# Altium project SEN_REVC.PrjPcb
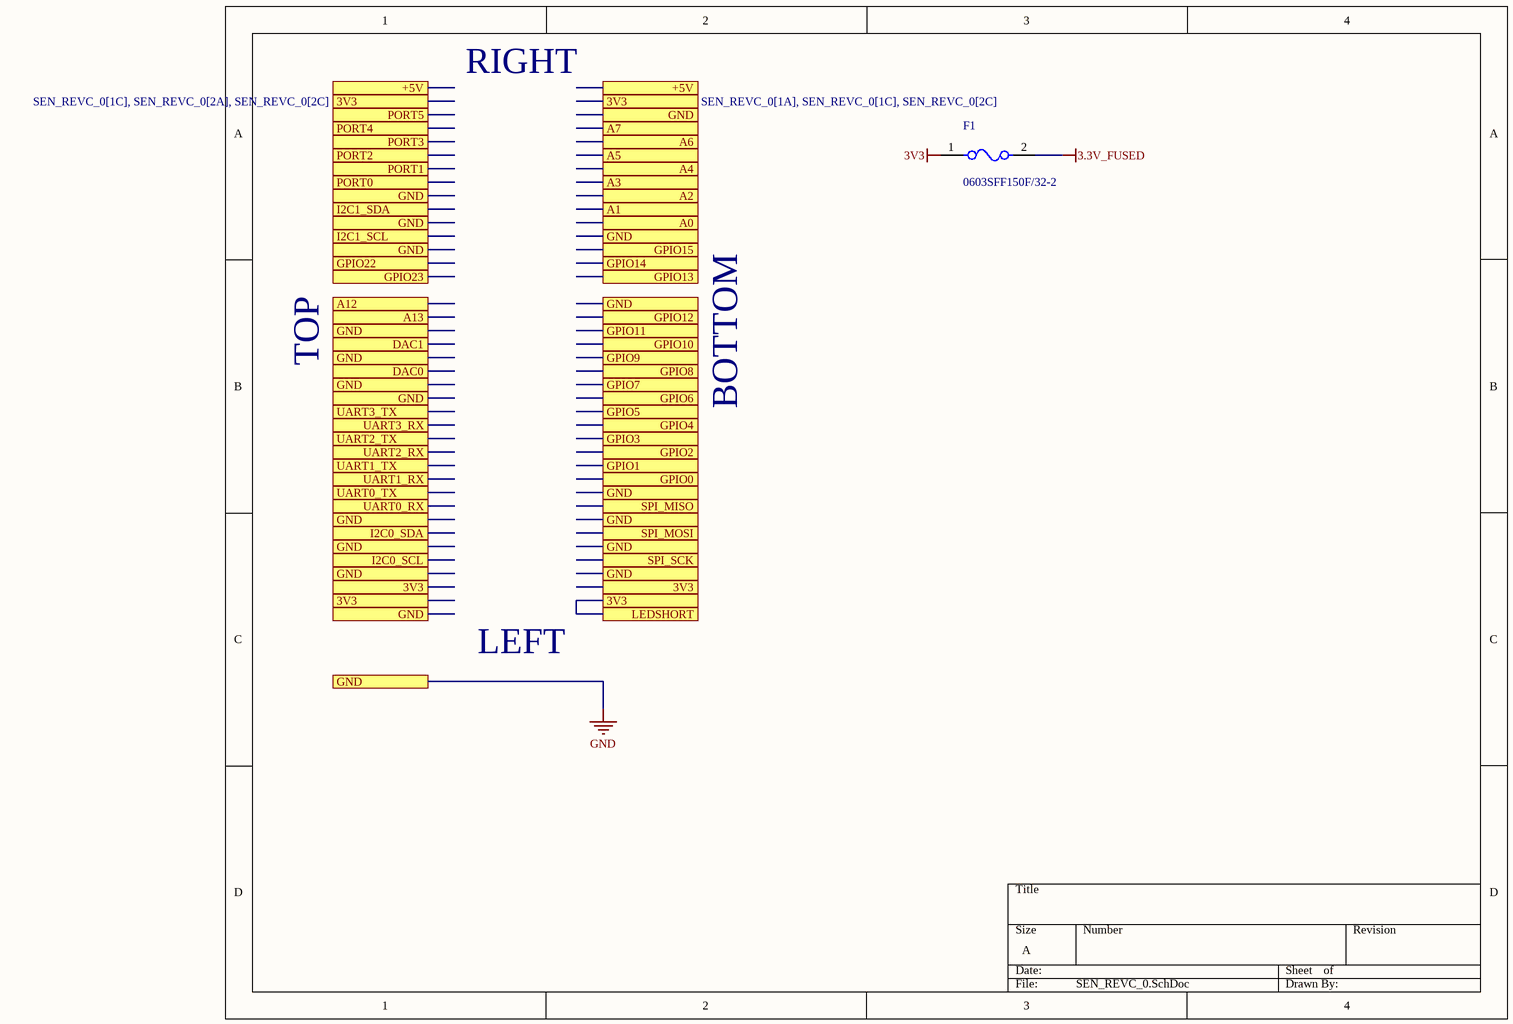
[diagram p0: SEN_REVC_0.SchDoc]
3 sheets, 59 parts. Net scope: flat (ports and power ports of the same name join across sheets).
Board file: SEN_REVC.PcbDoc
Sheets:
  SEN_REVC_0.SchDoc
  SEN_REVC_1.SchDoc
  SEN_REVC_2.SchDoc

## Sheet SEN_REVC_0.SchDoc
size A; SheetNumber: 1; SheetTotal: 3

### Parts
F1  0603SFF150F/32-2  [RESC1608X10N]

### Ports
3V3 (see SEN_REVC_0[1A], SEN_REVC_0[1C], SEN_REVC_0[2A], SEN_REVC_0[2C]), 3V3 (see SEN_REVC_0[1A], SEN_REVC_0[1C], SEN_REVC_0[2C]), 3V3 (see SEN_REVC_0[1C], SEN_REVC_0[2A], SEN_REVC_0[2C]), +5V (see SEN_REVC_0[1A]), +5V (see SEN_REVC_0[2A]), A0, A1, A2, A3, A4, A5, A6, A7, A12, A13, DAC0, DAC1, GND (see SEN_REVC_0[1A], SEN_REVC_0[1B], SEN_REVC_0[1C], SEN_REVC_0[2A], SEN_REVC_0[2B], SEN_REVC_0[2C]), GPIO0, GPIO1, GPIO2, GPIO3, GPIO4, GPIO5, GPIO6, GPIO7, GPIO8, GPIO9, GPIO10, GPIO11, GPIO12, GPIO13, GPIO14, GPIO15, GPIO22, GPIO23, I2C0_SCL, I2C0_SDA, I2C1_SCL, I2C1_SDA, LEDSHORT, PORT0, PORT1, PORT2, PORT3, PORT4, PORT5, SPI_MISO, SPI_MOSI, SPI_SCK, UART0_RX, UART0_TX, UART1_RX, UART1_TX, UART2_RX, UART2_TX, UART3_RX, UART3_TX

### Nets
3.3V_FUSED: F1.2
3V3: F1.1
3V3: port 3V3, port LEDSHORT  [a separate net that carries the same name]

### Notes on the sheet
- RIGHT
- TOP
- BOTTOM
- LEFT

### Library data of the parts
F1 = CMP-00019-1: 0603SFF Series - 0603 Size Lead-Free, Halogen Free, Fast-Acting Chip Fuse, 1.5 A, 63 VDC, RoHS; Approvals: UL; Fuse Type: Board Mount (Cartridge Style Excluded); DC Cold Resistance: 175mR; Current Rating: 500mA; Value: 175mR; Voltage Rating: 50V; Case/Package: 0603; Pins: 2; Mounting Technology: Surface Mount; Case Code (Metric): 1608; Fuse Current: 500mA; Reach SVHC Compliant: Yes; Series: SF-0603S; Width: 0.8mm; Max Operating Temperature: 105°C; Packaging: Tape and Reel; Depth: 0.8mm; Min Operating Temperature: -20°C; RoHS Compliant: Yes; Package Quantity: 10000; Height: 0.45mm; Length: 1.6mm; Current: 500mA; Case Code (Imperial): 0603; Contact Plating: Tin; Voltage Rating (DC): 50V; Termination: SMD/SMT

## Sheet SEN_REVC_1.SchDoc: Sensors
size 270 x 223 mm; SheetTotal: 3; Origin: Eagle; Date: 2019-04-04 11:51:56 PM; SheetNumber: 2; GateName_1: G$1; SymbolName_1: LETTER_L; LibraryName: frames; DeviceSetName: LETTER_L; GateName_2: G$2; SymbolName_2: DOCFIELD; Sheet: Sheet:; REV: REV:
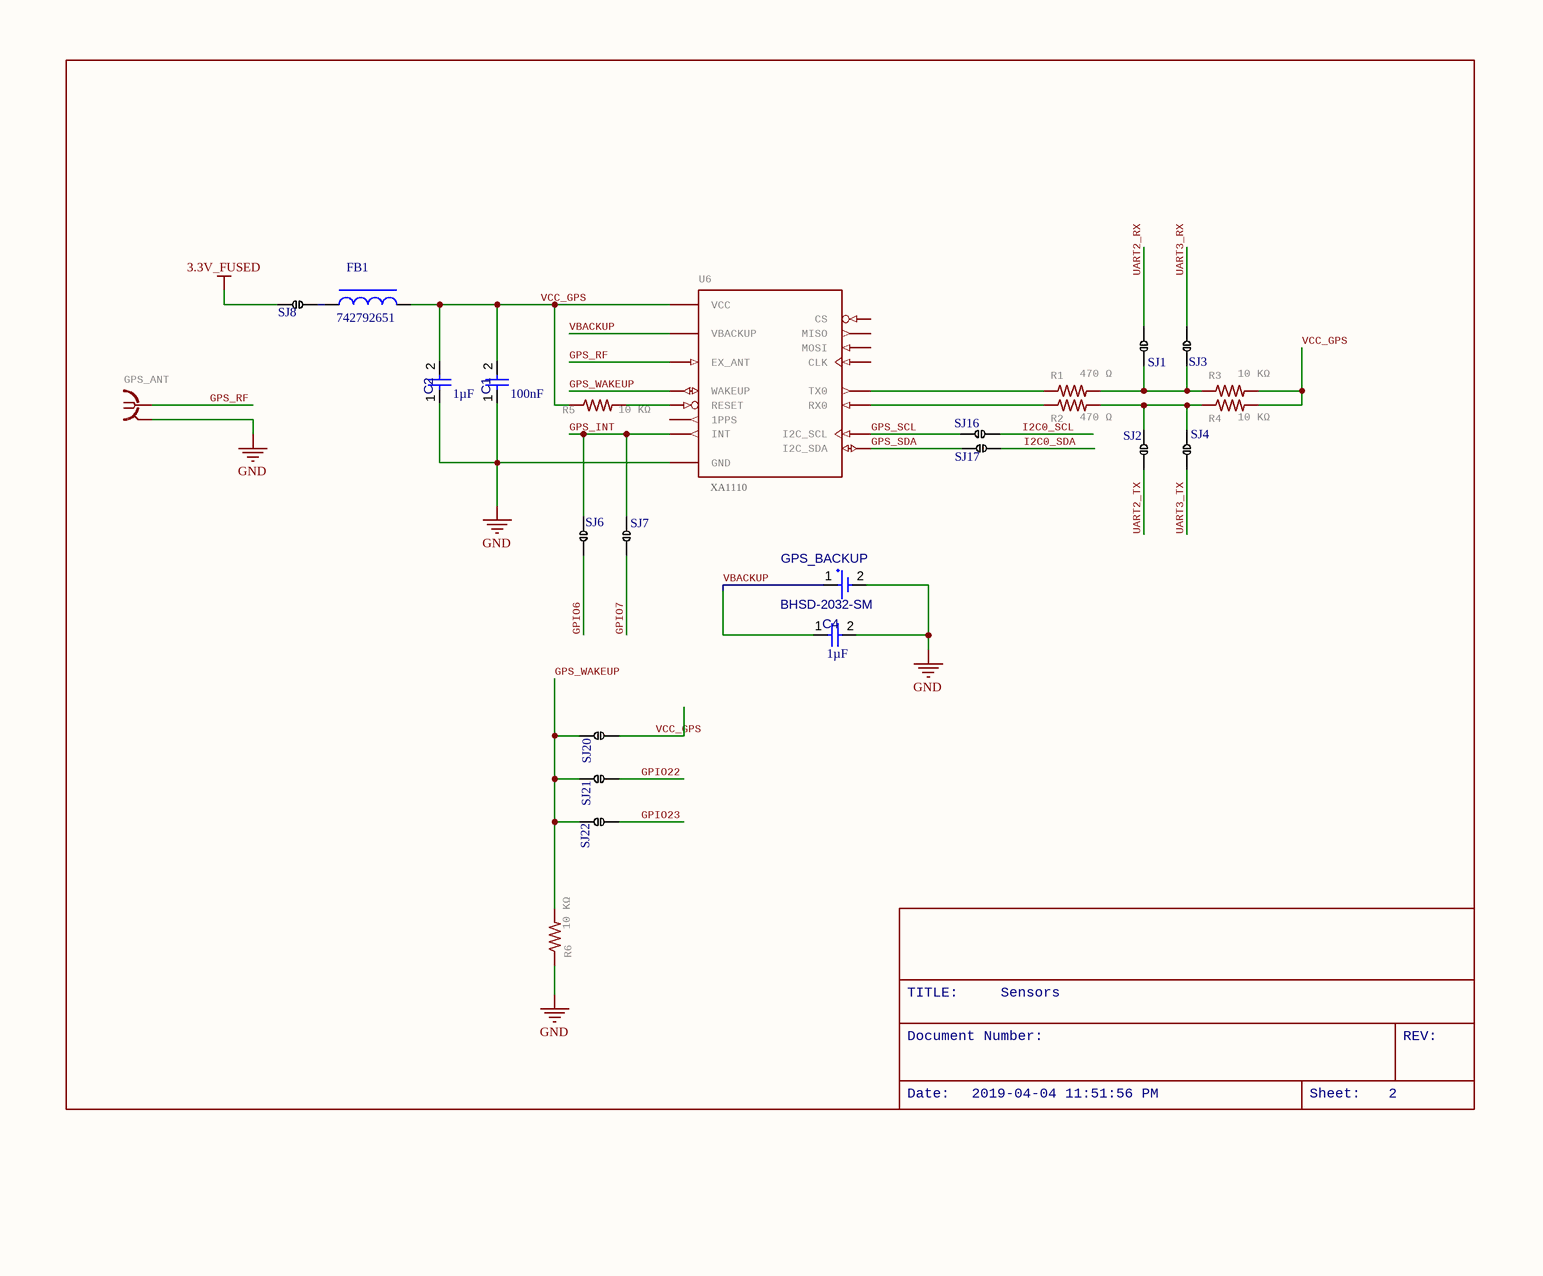
[diagram p1: SEN_REVC_1.SchDoc]

### Parts
C1  value 100nF  [CAPC2013X95X50LL10T25]  (hidden comment: Capacitor 100 nF +/-10% 50 V 0805)
C2  value 1µF  [CAPC2013X135X45NL10T25]  (hidden comment: Capacitor 1 uF +/- 10% 50 V 0805)
C4  value 1µF  [CAPC2013X135X45NL10T25]  (hidden comment: Capacitor 1 uF +/- 10% 50 V 0805)
FB1  742792651  [FP-742792651-MFG]
GPS_ANT  142-0701-801  [CINC-142-0701-801_V]  (value not drawn)
GPS_BACKUP  BHSD-2032-SM  [BHSD-2032-SM-Footprint-1]
R1  470 Ω  [6-0805_N]
R2  470 Ω  [6-0805_N]
R3  10 KΩ  [6-0805_N]
R4  10 KΩ  [6-0805_N]
R5  10 KΩ  [6-0805_N]
R6  10 KΩ  [6-0805_N]
SJ1  Solder Jumper  [Solder Jumper-Footprint-1]  (value not drawn)
SJ2  Solder Jumper  [Solder Jumper-Footprint-1]  (value not drawn)
SJ3  Solder Jumper  [Solder Jumper-Footprint-1]  (value not drawn)
SJ4  Solder Jumper  [Solder Jumper-Footprint-1]  (value not drawn)
SJ6  Solder Jumper  [Solder Jumper-Footprint-1]  (value not drawn)
SJ7  Solder Jumper  [Solder Jumper-Footprint-1]  (value not drawn)
SJ8  Solder Jumper  [Solder Jumper-Footprint-1]  (value not drawn)
SJ16  Solder Jumper  [Solder Jumper-Footprint-1]  (value not drawn)
SJ17  Solder Jumper  [Solder Jumper-Footprint-1]  (value not drawn)
SJ20  Solder Jumper  [Solder Jumper-Footprint-1]  (value not drawn)
SJ21  Solder Jumper  [Solder Jumper-Footprint-1]  (value not drawn)
SJ22  Solder Jumper  [Solder Jumper-Footprint-1]  (value not drawn)
U6  XA1110  [XA1110-Footprint-1]

### Nets
3.3V_FUSED: SJ8.0
GND: C1.1 C2.1 C4.2 GPS_ANT.GND,GND2(GND@1) GPS_BACKUP.2(-) R6.1 U6.P$1,3,4,5,6,9,10,11,24(GND)
GPIO6: SJ6.1
GPIO7: SJ7.1
GPIO22: SJ21.1
GPIO23: SJ22.1
GPS_INT: SJ6.0 SJ7.0 U6.P$16(INT)
GPS_RF: GPS_ANT.RF U6.P$2(EX_ANT)
GPS_SCL: SJ16.0 U6.P$14(I2C_SCL)
GPS_SDA: SJ17.0 U6.P$13(I2C_SDA)
GPS_WAKEUP: R6.2 SJ20.0 SJ21.0 SJ22.0 U6.P$12(WAKEUP)
I2C0_SCL: SJ16.1
I2C0_SDA: SJ17.1
UART2_RX: SJ1.1
UART2_TX: SJ2.1
UART3_RX: SJ3.1
UART3_TX: SJ4.1
VBACKUP: C4.1 GPS_BACKUP.1(+) U6.P$8(VBACKUP)
VCC_GPS: C1.2 C2.2 FB1.2 R3.2 R4.2 R5.1 SJ20.1 U6.P$7(VCC)
NetFB1_1: FB1.1 SJ8.1
NetR1_1: R1.1 U6.P$19(TX0)
NetR1_2: R1.2 R3.1 SJ1.0 SJ3.0
NetR2_1: R2.1 U6.P$20(RX0)
NetR2_2: R2.2 R4.1 SJ2.0 SJ4.0
NetR5_2: R5.2 U6.P$22(RESET)

Not connected (* = marked no-connect by the designer): U6 P$15(MISO) P$17(MOSI) P$18(CLK) P$21(1PPS) P$23(CS)

### Notes on the sheet
- TITLE:
- Sensors
- Document Number:
- REV:
- Date:
- 2019-04-04 11:51:56 PM
- Sheet:
- 2

### Library data of the parts
C1 = CMP-001-00018-6: Chip Capacitor, 100 nF, +/- 10%, 50 V, 0805 (2012 Metric); Capacitor Type: Ceramic; Voltage Rating: 50V; Pins: 2; Max Operating Temperature: 125°C; Min Operating Temperature: -55°C; Mounting Technology: SM; Case/Package: 0805; RoHS Compliant: True; Tolerance: 10%
C2 C4 = CMP-001-00007-6: Chip Capacitor, 1 uF, +/- 10%, 50 V, 0805 (2012 Metric); Capacitor Type: Ceramic; Voltage Rating: 50V; Min Operating Temperature: -55°C; RoHS Compliant: True; Mounting Technology: SM; Case/Package: 0805; Max Operating Temperature: 125°C; Tolerance: 10%; Pins: 2
FB1 = CMP-00022-1: Ferrite Beads WE-CBF 0603 SMD Bead 100MHz 600Ohm 1000mA; Max Current Rating: 1A; Tolerance: 25%; Value: 200mR; Number of Lines: 1; Impedance: 600R; Min Operating Temperature: -55°C; Depth: 0.8mm; Mounting Technology: Surface Mount; Height: 0.8mm; RoHS Compliant: Yes; Package Quantity: 1; Lead Free: Lead Free; Max Operating Temperature: 125°C; Case Code (Imperial): 0603; Case/Package: SMD/SMT; Max DC Current: 1A; Width: 0.8mm; Core Material: Ferrite; Material: Ferrite; Test Frequency: 100MHz; Termination: SMD/SMT; DC Resistance (DCR): 200mR; Weight: 0.000141oz; Packaging: Tape and Reel; Length: 1.6mm; Series: WE-CBF; Case Code (Metric): 1608; Current Rating: 1A
GPS_ANT = CMP-004-000004-3: RF Connectors / Coaxial Connectors SMA ST PCB-JCK STD EMT; pin to pad: GND,GND2>2+3+4+5 RF>1; GateName_1: G$1; SymbolName_1: BNC-F2; Gender: Female; Voltage Rating: 500V; Connector Type: SMA,Coaxial; Plating: Gold; Dielectric Material: PTFE; Mating Cycles: 500; Clock Frequency: 18GHz; Number of Ports: 1; Body Material: Brass; Impedance: 50R; Polarity: Standard; LibraryName: CU inSpace 2019 Parts; DeviceSetName: 5MMSMA; Design Item ID: 5MMSMA; Mounting Technology: Edge; Housing Color: Gold; Operating Frequency: N/A; Lead Free: Lead Free; Radiation Hardening: No; Case/Package: SMA; Fastening Type: Threaded; Orientation: Straight; Max Operating Temperature: 165°C; Package: 5MMSMA; RoHS Compliant: No; Depth: 16.26mm; Length: 6.35mm; Min Operating Temperature: -65°C; Termination: Solder; Series: 73251; Body Plating: Gold; Packaging: Bulk; Package Quantity: 1600; Insulation Material: Polytetrafluoroethylene; Contact Plating: Gold; Contact Material: Copper; Source: CU inSpace 2019 Parts.SCHLIB; Halogen Free: Low Halogen; Center Contact Plating: Gold
GPS_BACKUP = CMP-001-0000-2: Battery Holder 1 Cells Liquid Crystal Polymer Vectra T/R
R1-R6 = R-US_R1206: RESISTOR, American symbol; GateName_1: G$1; SymbolName_1: R-US; DeviceName: R1206; DeviceSetName: R-US_; LibraryName: rcl; SPICEPREFIX: R
SJ1-SJ4 SJ6-SJ8 SJ16 SJ17 SJ20-SJ22 = CMP-00020-3: pin to pad: 0>1 1>2
U6 = CMP-002-000018-2: Rx Txrx Module Surface Mount; pin to pad: P$1,3,4,5,6,9,10,11,24>1+3+4+5+6+9+10+11+24 P$2>2 P$7>7 P$8>8 P$12>12 P$13>13 P$14>14 P$15>15 P$16>16 P$17>17 P$18>18 P$19>19 P$20>20 P$21>21 P$22>22 P$23>23; GateName_1: G$1; SymbolName_1: XA1110; LibraryName: Sensors Board; DeviceSetName: XA1110; Source: Sensors Board.SCHLIB; Pin Count: 16; Design Item ID: XA1110; Package: XA1110; Component Type: Standard

## Sheet SEN_REVC_2.SchDoc: Sensors
size 270 x 223 mm; SheetTotal: 3; Origin: Eagle; Date: 2019-04-04 11:51:56 PM; SheetNumber: 3; GateName_1: G$1; SymbolName_1: LETTER_L; LibraryName: frames; DeviceSetName: LETTER_L; GateName_2: G$2; SymbolName_2: DOCFIELD; Sheet: Sheet:; REV: REV:
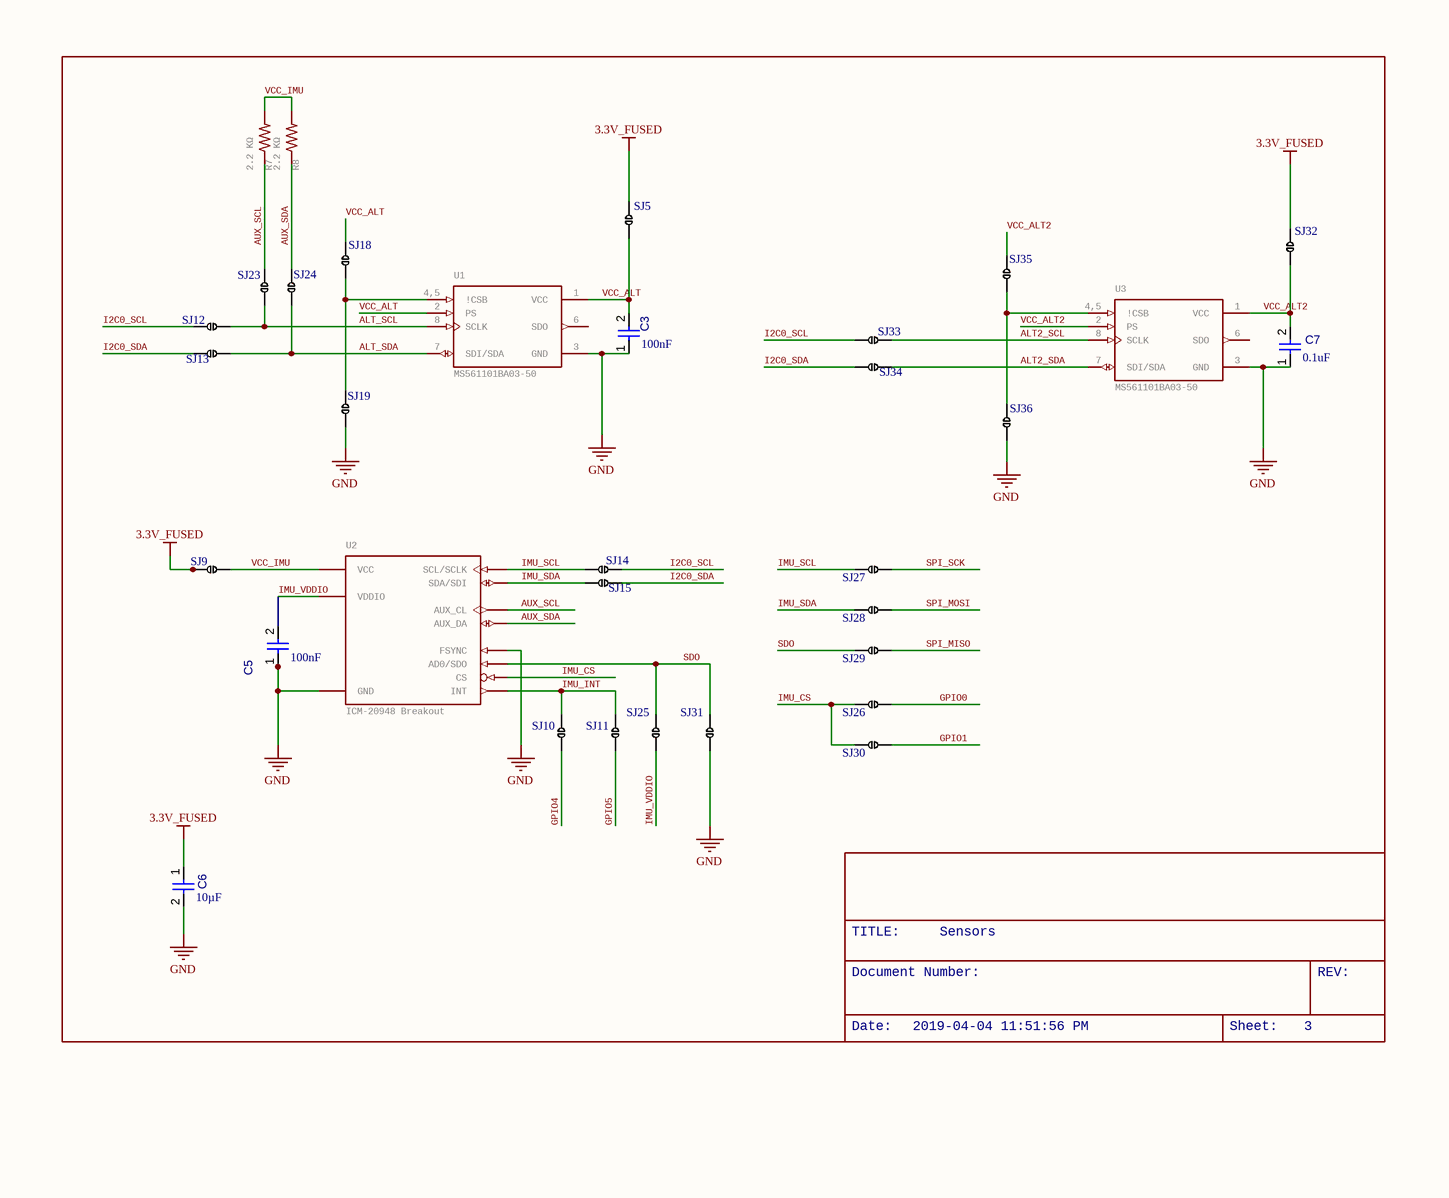
[diagram p2: SEN_REVC_2.SchDoc]

### Parts
C3  value 100nF  [CAPC2013X95X50LL10T25]  (hidden comment: Capacitor 100 nF +/-10% 50 V 0805)
C5  value 100nF  [CAPC2013X95X50LL10T25]  (hidden comment: Capacitor 100 nF +/-10% 50 V 0805)
C6  value 10µF  [CAPC3216X180X50NL20T25]  (hidden comment: Capacitor 10 uF +/- 10% 16 V 1206)
C7  value 0.1uF  [CAPC2013X95X50LL10T25]  (hidden comment: Capacitor 100 nF +/-10% 50 V 0805)
R7  2.2 KΩ  [6-0805_N]
R8  2.2 KΩ  [6-0805_N]
SJ5  Solder Jumper  [Solder Jumper-Footprint-1]  (value not drawn)
SJ9  Solder Jumper  [Solder Jumper-Footprint-1]  (value not drawn)
SJ10  Solder Jumper  [Solder Jumper-Footprint-1]  (value not drawn)
SJ11  Solder Jumper  [Solder Jumper-Footprint-1]  (value not drawn)
SJ12  Solder Jumper  [Solder Jumper-Footprint-1]  (value not drawn)
SJ13  Solder Jumper  [Solder Jumper-Footprint-1]  (value not drawn)
SJ14  Solder Jumper  [Solder Jumper-Footprint-1]  (value not drawn)
SJ15  Solder Jumper  [Solder Jumper-Footprint-1]  (value not drawn)
SJ18  Solder Jumper  [Solder Jumper-Footprint-1]  (value not drawn)
SJ19  Solder Jumper  [Solder Jumper-Footprint-1]  (value not drawn)
SJ23  Solder Jumper  [Solder Jumper-Footprint-1]  (value not drawn)
SJ24  Solder Jumper  [Solder Jumper-Footprint-1]  (value not drawn)
SJ25  Solder Jumper  [Solder Jumper-Footprint-1]  (value not drawn)
SJ26  Solder Jumper  [Solder Jumper-Footprint-1]  (value not drawn)
SJ27  Solder Jumper  [Solder Jumper-Footprint-1]  (value not drawn)
SJ28  Solder Jumper  [Solder Jumper-Footprint-1]  (value not drawn)
SJ29  Solder Jumper  [Solder Jumper-Footprint-1]  (value not drawn)
SJ30  Solder Jumper  [Solder Jumper-Footprint-1]  (value not drawn)
SJ31  Solder Jumper  [Solder Jumper-Footprint-1]  (value not drawn)
SJ32  Solder Jumper  [Solder Jumper-Footprint-1]  (value not drawn)
SJ33  Solder Jumper  [Solder Jumper-Footprint-1]  (value not drawn)
SJ34  Solder Jumper  [Solder Jumper-Footprint-1]  (value not drawn)
SJ35  Solder Jumper  [Solder Jumper-Footprint-1]  (value not drawn)
SJ36  Solder Jumper  [Solder Jumper-Footprint-1]  (value not drawn)
U1  MS561101BA03-50  [MSI-MS561101BA03-50-8_V]
U2  ICM-20948 Breakout  [New footprint 1]
U3  MS561101BA03-50  [MSI-MS561101BA03-50-8_V]

### Nets
3.3V_FUSED: C6.1 SJ5.0 SJ9.0 SJ32.0
GND: C3.1 C5.1 C6.2 C7.1 SJ19.1 SJ31.1 SJ36.1 U1.3(GND) U2.FSYNC U2.GND U3.3(GND)
ALT2_SCL: SJ33.1 U3.8(SCLK)
ALT2_SDA: SJ34.1 U3.7(SDI/SDA)
ALT_SCL: SJ12.1 SJ23.1 U1.8(SCLK)
ALT_SDA: SJ13.1 SJ24.1 U1.7(SDI/SDA)
AUX_SCL: R7.1 SJ23.0 U2.AUX_CL
AUX_SDA: R8.1 SJ24.0 U2.AUX_DA
GPIO0: SJ26.1
GPIO1: SJ30.1
GPIO4: SJ10.1
GPIO5: SJ11.1
I2C0_SCL: SJ12.0 SJ14.1 SJ33.0
I2C0_SDA: SJ13.0 SJ15.1 SJ34.0
IMU_CS: SJ26.0 SJ30.0 U2.NCS(CS)
IMU_INT: SJ10.0 SJ11.0 U2.INT
IMU_SCL: SJ14.0 SJ27.0 U2.SCL/SCLK
IMU_SDA: SJ15.0 SJ28.0 U2.SDA/SDI
IMU_VDDIO: C5.2 SJ25.1 U2.VDDIO
SDO: SJ25.0 SJ29.0 SJ31.0 U2.AD0/SDO
SPI_MISO: SJ29.1
SPI_MOSI: SJ28.1
SPI_SCK: SJ27.1
VCC_ALT: C3.2 SJ5.1 SJ18.0 U1.1(VCC) U1.2(PS)
VCC_ALT2: C7.2 SJ32.1 SJ35.0 U3.1(VCC) U3.2(PS)
VCC_IMU: R7.2 R8.2 SJ9.1 U2.VDD(VCC)
NetSJ18_1: SJ18.1 SJ19.0 U1.4,5(!CSB)
NetSJ35_1: SJ35.1 SJ36.0 U3.4,5(!CSB)

Not connected (* = marked no-connect by the designer): U1 6(SDO); U3 6(SDO)

### Notes on the sheet
- TITLE:
- Sensors
- Document Number:
- REV:
- Date:
- 2019-04-04 11:51:56 PM
- Sheet:
- 3

### Library data of the parts
C3 C5 C7 = CMP-001-00018-6: as C1 on sheet SEN_REVC_1; Pins: 2; Max Operating Temperature: 125°C; Min Operating Temperature: -55°C; Mounting Technology: SM; Case/Package: 0805; RoHS Compliant: True; Tolerance: 10%
C6 = CMP-001-00016-6: Chip Capacitor, 10 uF, +/- 10%, 16 V, 1206 (3216 Metric); Capacitor Type: Ceramic; Voltage Rating: 16V; Tolerance: 10%; Min Operating Temperature: -55°C; Pins: 2; Mounting Technology: SM; Case/Package: 1206; Max Operating Temperature: 125°C; RoHS Compliant: True
R7 R8 = R-US_R1206: as R1 on sheet SEN_REVC_1; LibraryName: rcl; SPICEPREFIX: R
SJ5 SJ9-SJ15 SJ18 SJ23-SJ36 = CMP-00020-3: pin to pad: 0>1 1>2
SJ19 = CMP-00020-2
U1 U3 = CMP-002-000017-2: Pressure Sensor 1.44V to 3.6V 0.01bar to 1.2bar Absolute 8-Pin QFN T/R; pin to pad: 4,5>4+5; GateName_1: G$1; MF: TE Connectivity; Min Supply Voltage: 1.8V; Operating Supply Current: 12.5uA; Pressure Type: Barometric; Output Type: Digital; Operating Supply Voltage: 3V; Interface: I2C,SPI; Resolution: 24b; SymbolName_1: MS561101BA03-50; LibraryName: Sensors Board; DeviceSetName: MS561101BA03-50; AVAILABILITY: Unavailable; EU_ROHS_COMPLIANCE: Compliant; MP: MS561101BA03-50; Package: SON125P500X300X100-8N; PRICE: None; TE_PURCHASE_URL: https://www.te.com/usa-en/product-MS561101BA03-50.html?te_bu=Cor&te_type=disp&te_campaign=seda_glo_cor-seda-global-disp-prtnr-fy19-seda-model-bom-cta_sma-317_1&elqCampaignId=32493; Component Type: Standard; Pin Count: 7; Design Item ID: MS561101BA03-50; Source: Sensors Board.SCHLIB; Min Operating Temperature: -40°C; Case/Package: QFN; Max Supply Voltage: 3.6V; Mounting Technology: Surface Mount; Max Operating Temperature: 85°C; Pins: 8; Package Quantity: 3600; Radiation Hardening: No; RoHS Compliant: Yes; Packaging: Tape and Reel; Output Voltage: 3.6V; Nominal Supply Current: 12.5uA; Reach SVHC Compliant: Yes; Supply Current: 12.5uA
U2 = CMP-00021-1: Sparkfun ICM-20948 breakout; pin to pad: AD0/SDO>11 AUX_CL>5 AUX_DA>4 FSYNC>3 GND>1+7 INT>2 NCS>12 SCL/SCLK>10 SDA/SDI>9 VDD>6 VDDIO>8

## Nets that join several sheets
3.3V_FUSED: SEN_REVC_0 (F1.2), SEN_REVC_1 (SJ8.0), SEN_REVC_2 (C6.1 SJ5.0 SJ9.0 SJ32.0)
GND: SEN_REVC_1 (7 pins), SEN_REVC_2 (11 pins)